# Altium schematic sheet EDR_RFID_READER.SchDoc
size A4; SheetNumber: 1; SheetTotal: 1
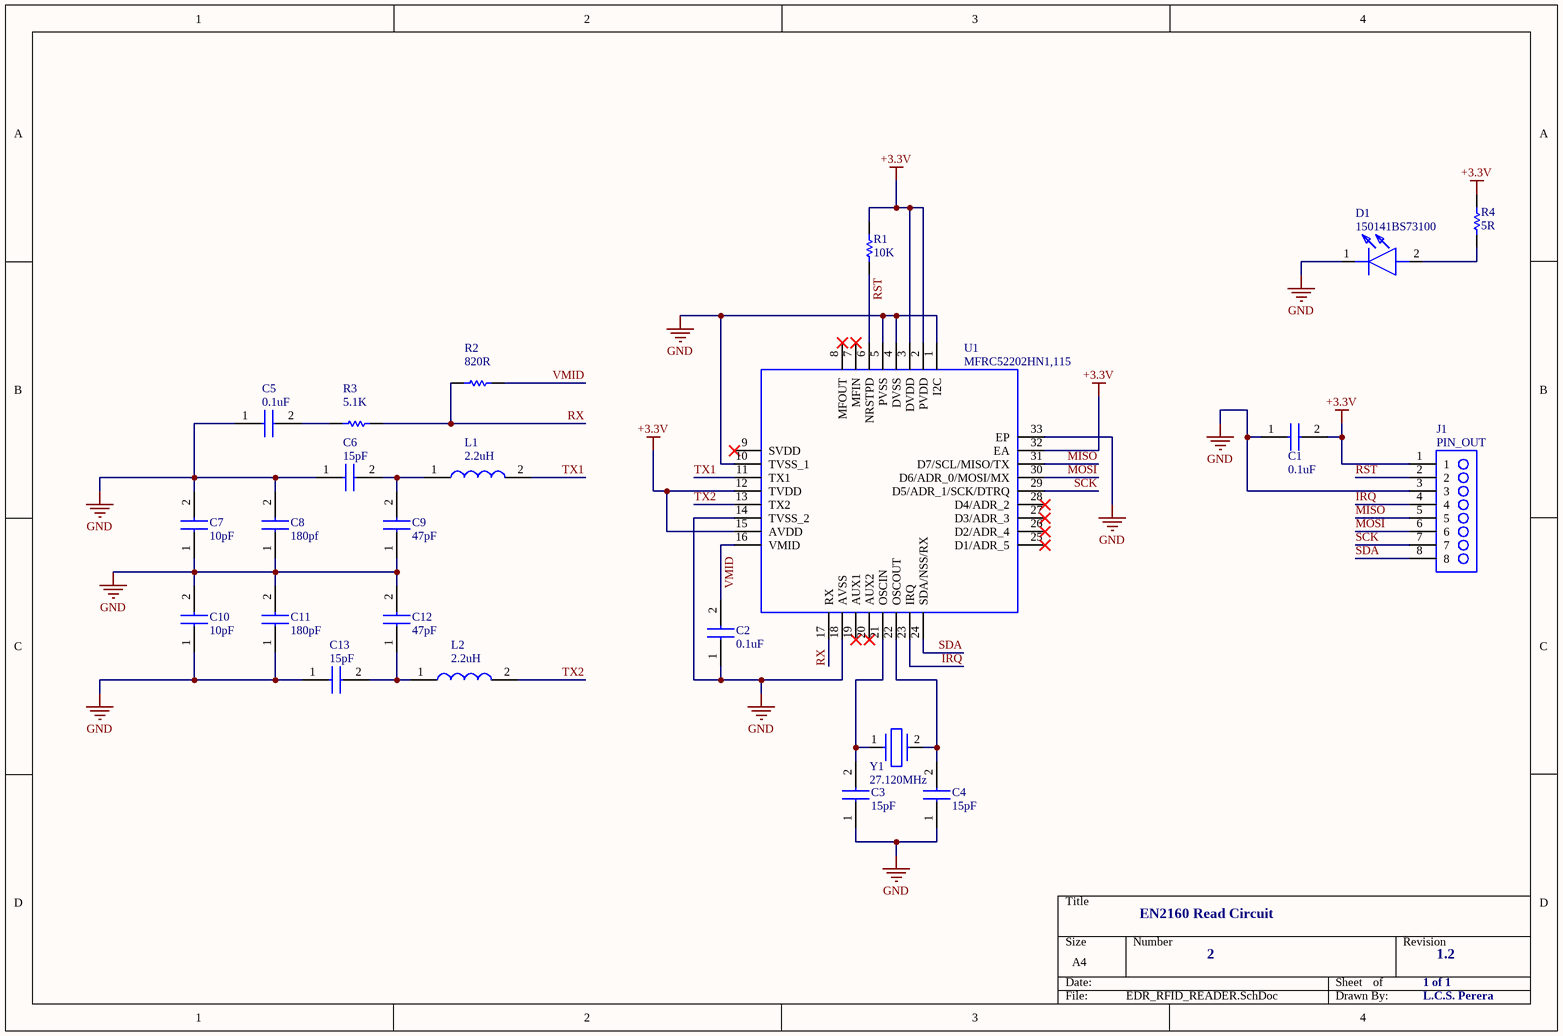
[diagram p0: EDR_RFID_READER.SchDoc]

## Parts
C1  0.1uF  [0.1u]
C2  0.1uF  [0.1u]
C3  15pF  [15pf]
C4  15pF  [15pf]
C5  0.1uF  [0.1u]
C6  15pF  [15pf]
C7  10pF  [10pf]
C8  180pf  [15pf]
C9  47pF  [47pf]
C10  10pF  [10pf]
C11  180pF  [15pf]
C12  47pF  [47pf]
C13  15pF  [15pf]
D1  150141BS73100  [LEDM3528X210N]
J1  PIN_OUT  [8X1]
L1  2.2uH  [2.2U]
L2  2.2uH  [2.2U]
R1  10K  [10k]
R2  820R  [820]
R3  5.1K  [5.1k]
R4  5R  [1k]
U1  MFRC52202HN1,115  [MFRC522]
Y1  27.120MHz  [27.120]

## Nets
+3.3V: C1.2 J1.1 R1.2 R4.2 U1.2(PVDD) U1.3(DVDD) U1.12(TVDD) U1.15(AVDD) U1.32(EA)
GND: C1.1 C2.1 C3.1 C4.1 C5.1 C6.1 C7.1 C7.2 C8.1 C8.2 C9.1 C10.1 C10.2 C11.1 C11.2 C12.2 C13.1 D1.1(K) J1.3 U1.1(I2C) U1.4(DVSS) U1.5(PVSS) U1.10(TVSS_1) U1.14(TVSS_2) U1.18(AVSS) U1.33(EP)
IRQ: J1.4 U1.23(IRQ)
MISO: J1.5 U1.31(D7/SCL/MISO/TX)
MOSI: J1.6 U1.30(D6/ADR_0/MOSI/MX)
RST: J1.2 R1.1 U1.6(NRSTPD)
RX: R2.1 R3.2 U1.17(RX)
SCK: J1.7 U1.29(D5/ADR_1/SCK/DTRQ)
SDA: J1.8 U1.24(SDA/NSS/RX)
TX1: L1.2 U1.11(TX1)
TX2: L2.2 U1.13(TX2)
VMID: C2.2 R2.2 U1.16(VMID)
NetC3_2: C3.2 U1.21(OSCIN) Y1.1
NetC4_2: C4.2 U1.22(OSCOUT) Y1.2
NetC5_2: C5.2 R3.1
NetC6_2: C6.2 C9.2 L1.1
NetC12_1: C12.1 C13.2 L2.1
NetD1_2: D1.2(A) R4.1

Not connected (* = marked no-connect by the designer): U1 7(MFIN)* 8(MFOUT)* 9(SVDD)* 19(AUX1)* 20(AUX2)* 25(D1/ADR_5)* 26(D2/ADR_4)* 27(D3/ADR_3)* 28(D4/ADR_2)*

## Notes on the sheet
- EN2160 Read Circuit
- 2
- 1 of 1
- 1.2
- L.C.S. Perera

## Library data of the parts
C1 C2 C5 = 0.1uF: Capacitor; Manufacturer_Name: KEMET; Manufacturer_Part_Number: C0603C104K1RACTU; Datasheet Link: https://search.kemet.com/component-documentation/download/specsheet/C0603C104K1RACTU; Height: 0.95mm; Mouser Part Number: 80-C0603C104K1RACTU; Mouser Price/Stock: https://www.mouser.co.uk/ProductDetail/KEMET/C0603C104K1RACTU?qs=ulEaXIWI0c%252BGZAOcX%252BBs5A%3D%3D
C3 C4 C6 C13 = C0805X150F4HACAUTO: Capacitor; Manufacturer_Name: KEMET; Datasheet Link: https://www.kemet.com/specsheet/C0805X150F4HACAUTO; Height: 0.98mm; Manufacturer_Part_Number: C0805X150F4HACAUTO; Mouser Part Number: 80-C0805X150F4HAUTO; Mouser Price/Stock: https://www.mouser.co.uk/ProductDetail/KEMET/C0805X150F4HACAUTO?qs=r5DSvlrkXmKlHoNfpD1G%252BA%3D%3D
C7 C10 = C0805C100J5GACTU: Ceramic Multilayer Capacitor; Capacitor Type:General Purpose; Capacitance:10pF; Capacitance Tolerance:Â± 5%; Voltage Rating:50V; Capacitor Dielectric Type:Multilayer Ceramic; Package/Case:0805; Termination Type:SMD ;RoHS Compliant: Yes; Package: None; Price: None; Value: *; MP: C0805C100J5GACTU; Availability: Unavailable
C8 C11 = C0805C181F1GACTU: Capacitor; Manufacturer_Name: KEMET; Datasheet Link: https://content.kemet.com/datasheets/KEM_C1003_C0G_SMD.pdf; Height: 1.1mm; Manufacturer_Part_Number: C0805C181F1GACTU
C9 C12 = C0805C470JDGACTU: Capacitor; Manufacturer_Name: KEMET; Datasheet Link: https://content.kemet.com/datasheets/KEM_C1009_C0G_HV_SMD.pdf; Height: 1.1mm; Manufacturer_Part_Number: C0805C470JDGACTU; Mouser Part Number: 80-C0805C470JDG; Mouser Price/Stock: https://www.mouser.co.uk/ProductDetail/KEMET/C0805C470JDGACTU?qs=HkDAmeg8w%252BfhZX5bPX%2F3Fg%3D%3D
D1 = 150141BS73100: LED; Manufacturer_Name: Wurth Elektronik; Datasheet Link: http://katalog.we-online.de/led/datasheet/150141BS73100.pdf; Height: 2.1mm; Manufacturer_Part_Number: 150141BS73100; Mouser Part Number: 710-150141BS73100; Mouser Price/Stock: https://www.mouser.co.uk/ProductDetail/Wurth-Elektronik/150141BS73100?qs=2kOmHSv6VfT0lsqABpjXuQ%3D%3D
J1 = 61300811121_1: Connector; Manufacturer_Name: Wurth Elektronik; Datasheet Link: http://katalog.we-online.de/em/datasheet/6130xx11121.pdf; Height: 8.54mm; Manufacturer_Part_Number: 61300811121; Mouser Part Number: 710-61300811121; Mouser Price/Stock: https://www.mouser.co.uk/ProductDetail/Wurth-Elektronik/61300811121?qs=PhR8RmCirEZRdx%252BVlEmRRA%3D%3D
L1 L2 = ASMPM-0806-2R2M-T: Inductor; Manufacturer_Name: ABRACON; Datasheet Link: https://abracon.com/Magnetics/power/ASMPM.pdf; Height: 1mm; Manufacturer_Part_Number: ASMPM-0806-2R2M-T; Mouser Part Number: 815-ASMPM-0806-2.2MT; Mouser Price/Stock: https://www.mouser.co.uk/ProductDetail/ABRACON/ASMPM-0806-2R2M-T?qs=f9yNj16SXrKN59zM%2FB%252B15A%3D%3D; Arrow Part Number: ASMPM-0806-2R2M-T; Arrow Price/Stock: https://www.arrow.com/en/products/asmpm-0806-2r2m-t/abracon
R1 = CR0805-FX-1002ELF: Resistor; Manufacturer_Name: Bourns; Datasheet Link: https://www.bourns.com/pdfs/chpreztr.pdf; Height: 0.6mm; Manufacturer_Part_Number: CR0805-FX-1002ELF; Mouser Part Number: 652-CR0805FX-1002ELF; Mouser Price/Stock: https://www.mouser.co.uk/ProductDetail/Bourns/CR0805-FX-1002ELF?qs=tknLyCMIRbPr%252BDD0s0nG9g%3D%3D; Arrow Part Number: CR0805-FX-1002ELF; Arrow Price/Stock: https://www.arrow.com/en/products/cr0805-fx-1002elf/bourns?region=nac
R2 = 0805W8F8200T5E: Resistor; Manufacturer_Name: UNI-ROYAL(Uniroyal Elec); Datasheet Link: https://datasheet.lcsc.com/szlcsc/Uniroyal-Elec-0805W8F8200T5E_C17837.pdf; Height: 0.65mm; Manufacturer_Part_Number: 0805W8F8200T5E
R3 = CR0805-FX-5101ELF: Resistor; Manufacturer_Name: Bourns; Datasheet Link: https://www.bourns.com/pdfs/chpreztr.pdf; Height: 0.6mm; Manufacturer_Part_Number: CR0805-FX-5101ELF; Mouser Part Number: 652-CR0805FX-5101ELF; Mouser Price/Stock: https://www.mouser.co.uk/ProductDetail/Bourns/CR0805-FX-5101ELF?qs=LA9FZBosJlADRz3sArKRTQ%3D%3D; Arrow Part Number: CR0805-FX-5101ELF; Arrow Price/Stock: https://www.arrow.com/en/products/cr0805-fx-5101elf/bourns?region=nac
R4 = CHP0805AFX-1002ELF1k: Resistor; Manufacturer_Name: Bourns; Datasheet Link: https://th.mouser.com/datasheet/2/54/chp-a-1858677.pdf; Height: 0.6mm; Manufacturer_Part_Number: CHP0805AFX-1002ELF; Mouser Part Number: 652-CHP0805AFX1002EL; Mouser Price/Stock: https://www.mouser.co.uk/ProductDetail/Bourns/CHP0805AFX-1002ELF?qs=BJlw7L4Cy79Jv8LZuArCYQ%3D%3D
U1 = MFRC52202HN1,115: Integrated Circuit; Manufacturer_Name: NXP; Datasheet Link: http://www.nxp.com/docs/en/data-sheet/MFRC522.pdf; Height: 1mm; Manufacturer_Part_Number: MFRC52202HN1,115; Mouser Part Number: 771-MFRC52202HN1115; Mouser Price/Stock: https://www.mouser.co.uk/ProductDetail/NXP-Semiconductors/MFRC52202HN1115?qs=cbprxTG2Yq%2F%252BkR%2FEgMbBLA%3D%3D; Arrow Part Number: MFRC52202HN1,115; Arrow Price/Stock: https://www.arrow.com/en/products/mfrc52202hn1115/nxp-semiconductors?region=nac
Y1 = ABLS-27.120MHZ-B4-F-T: Crystal or Oscillator; Manufacturer_Name: ABRACON; Datasheet Link: https://abracon.com/Resonators/abls.pdf; Manufacturer_Part_Number: ABLS-27.120MHZ-B4-F-T; Mouser Part Number: 815-ABLS27120MHZB4FT; Mouser Price/Stock: https://www.mouser.co.uk/ProductDetail/ABRACON/ABLS-27.120MHZ-B4-F-T?qs=vmHwEFxEFR8KmFALP9AakA%3D%3D; Arrow Part Number: ABLS-27.120MHZ-B4-F-T; Arrow Price/Stock: https://www.arrow.com/en/products/abls-27.120mhz-b4-f-t/abracon?region=nac